# EAGLE schematic Schematic of PAPR v11 (EAGLE 9.7.0)
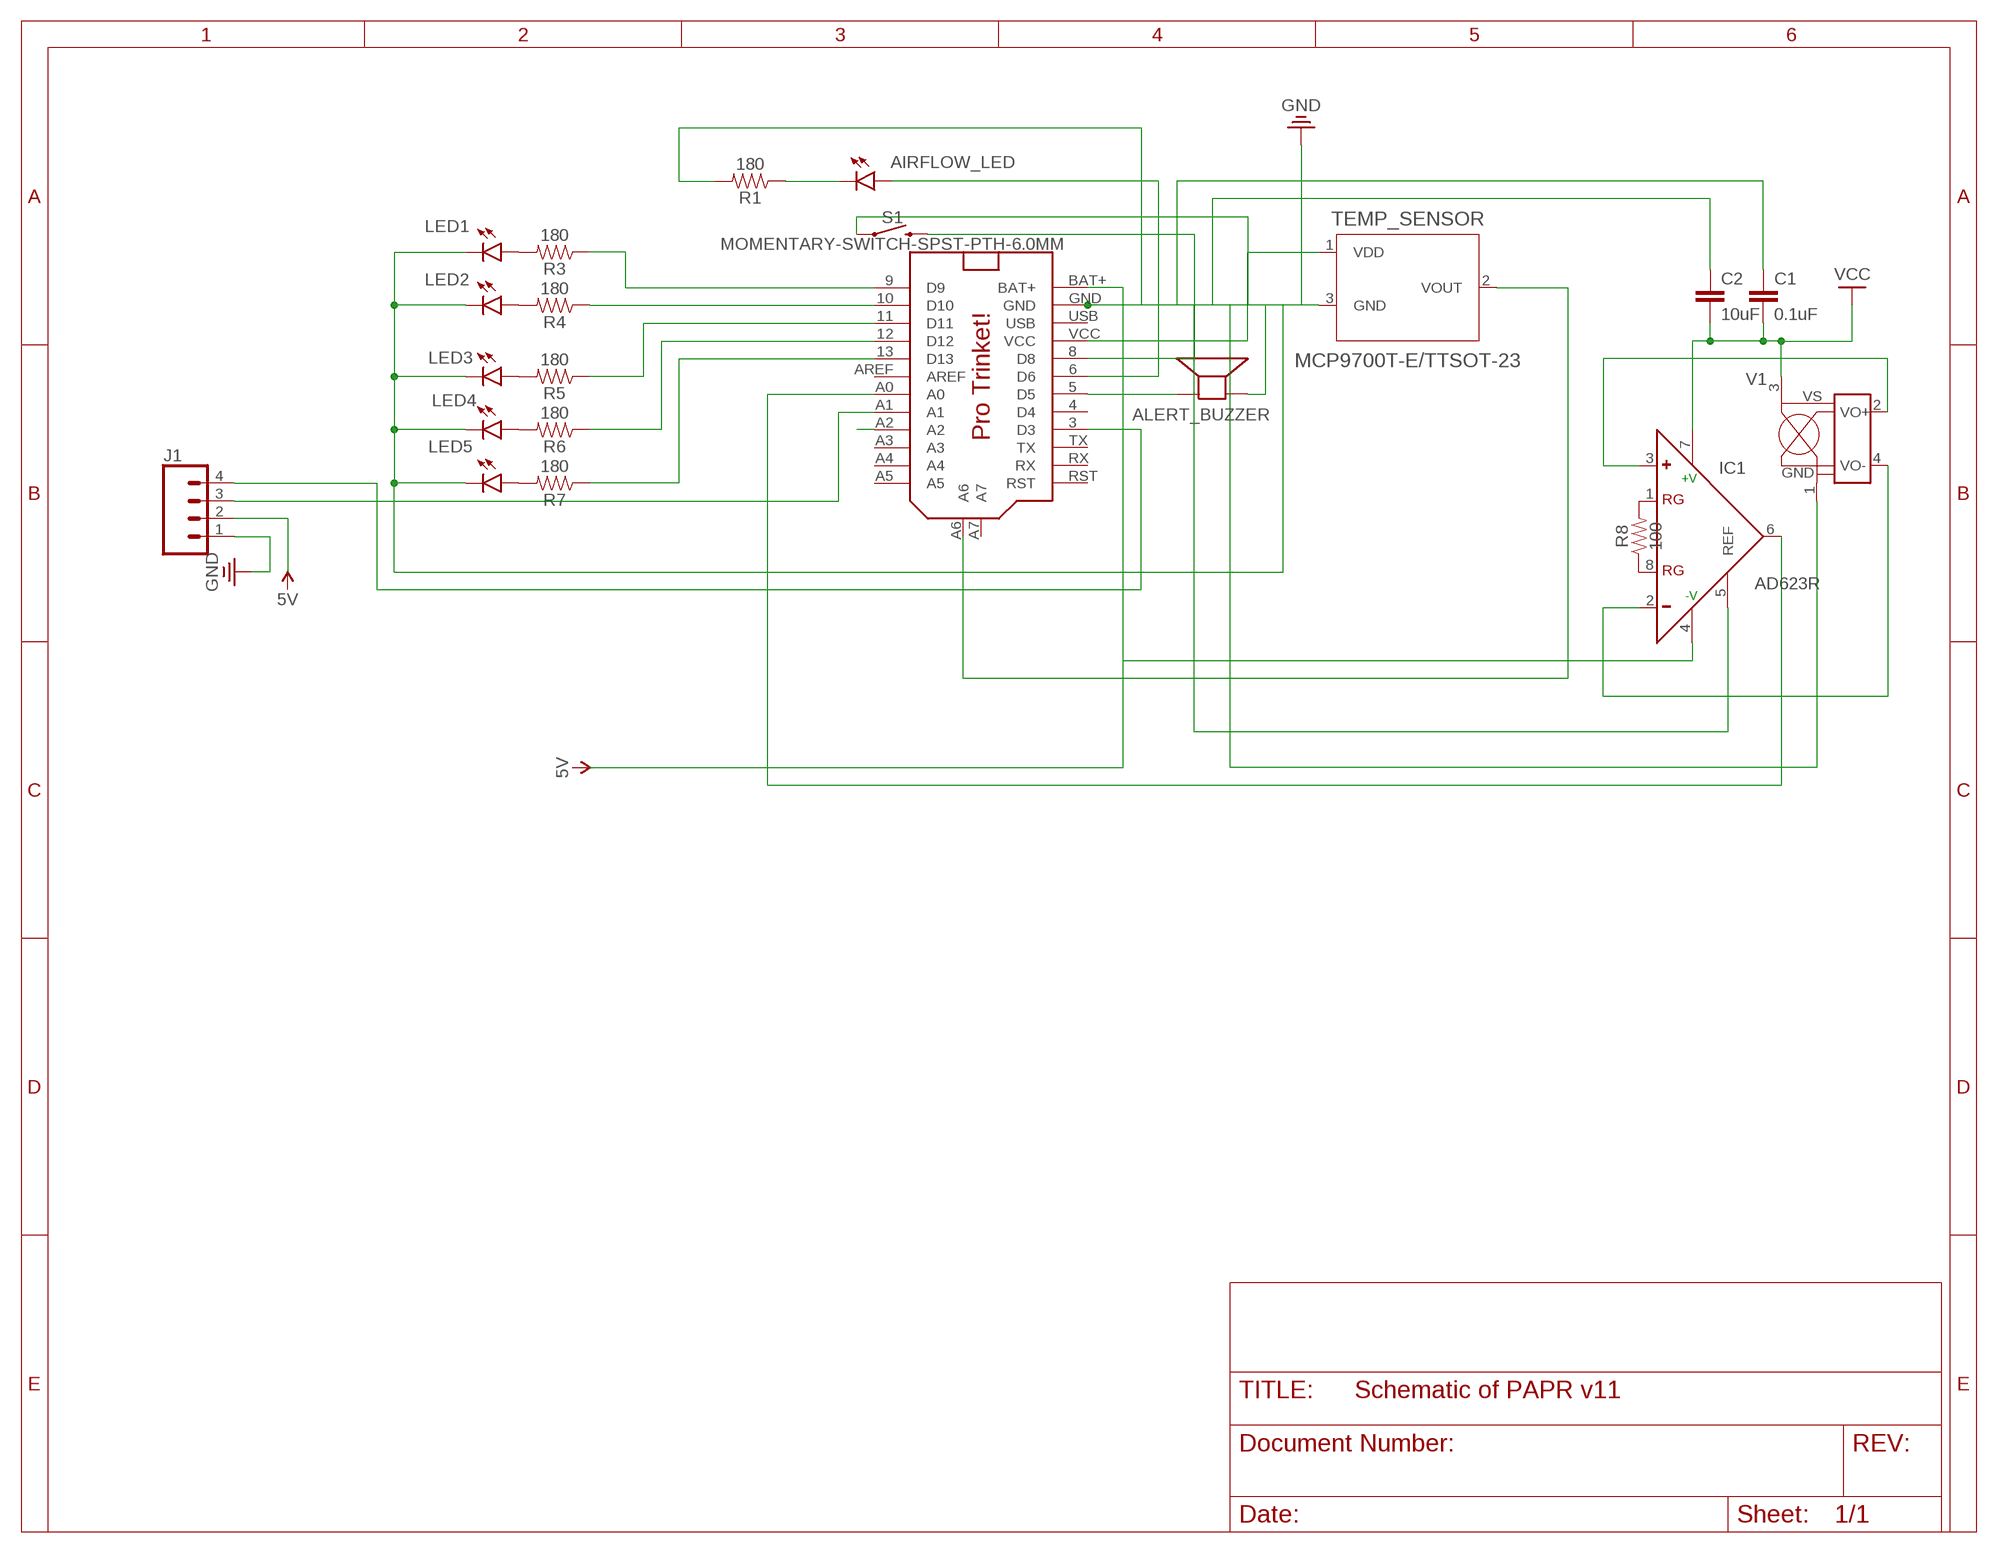
[diagram p0: schematic, sheet 1]

## Parts
AIRFLOW_LED  LED_CHIP_RED-1608  [LEDC1608X39N_R]
ALERT_BUZZER  SMT-0540-S-R  [SMT-0540-S-R]
C1  0.1uF  0.1UF-0402-16V-10%  [0402]
C2  10uF  10UF-0603-6.3V-20%  [0603]
IC1  AD623R  [SO8]
J1  CONN_04JST-PTH-VERT  [JST-4-PTH-VERT]
LED1  LED_CHIP_RED-1608  [LEDC1608X39N_R]
LED2  LED_CHIP_RED-1608  [LEDC1608X39N_R]
LED3  LED_CHIP_GREEN-1608  [LEDC1608X39N_G]
LED4  LED_CHIP_GREEN-1608  [LEDC1608X39N_G]
LED5  LED_CHIP_GREEN-1608  [LEDC1608X39N_G]
R1  180  180OHM-0603-1/10W-1%  [0603]
R3  180  180OHM-0603-1/10W-1%  [0603]
R4  180  180OHM-0603-1/10W-1%  [0603]
R5  180  180OHM-0603-1/10W-1%  [0603]
R6  180  180OHM-0603-1/10W-1%  [0603]
R7  180  180OHM-0603-1/10W-1%  [0603]
R8  100  100OHM-0603-1/4W-5%  [0603]
S1  MOMENTARY-SWITCH-SPST-PTH-6.0MM  [TACTILE_SWITCH_PTH_6.0MM]
TEMP_SENSOR  MCP9700T-E/TTSOT-23  [SOT95P237X112-3N]
U$2  PRO_TRINKET  [PROTRINKET]
V1  MPX2050GPV  [MPX2050GPV]

## Nets
GND: ALERT_BUZZER.+(-) C1.1 C2.1 IC1.4(-V) IC1.5(REF) J1.1 LED1.2(C) LED2.2(C) LED3.2(C) LED4.2(C) LED5.2(C) R1.2 S1.1 TEMP_SENSOR.3(GND) U$2.GND V1.1(GND)
N$1: AIRFLOW_LED.1(A) U$2.6(D6)
N$2: R7.1 U$2.13(D13)
N$3: AIRFLOW_LED.2(C) R1.1
N$4: S1.3 U$2.8(D8)
N$5: ALERT_BUZZER.-(+) U$2.5(D5)
N$6: TEMP_SENSOR.1(VDD) U$2.VCC
N$7: LED1.1(A) R3.2
N$8: LED2.1(A) R4.2
N$9: LED3.1(A) R5.2
N$10: LED4.1(A) R6.2
N$11: LED5.1(A) R7.2
N$12: R3.1 U$2.9(D9)
N$13: R4.1 U$2.10(D10)
N$14: R5.1 U$2.11(D11)
N$15: R6.1 U$2.12(D12)
N$16: IC1.1(RG) R8.2
N$17: IC1.8(RG) R8.1
N$19: IC1.3(+) V1.2(VO+)
N$20: IC1.2(-) V1.4(VO-)
N$21: TEMP_SENSOR.2(VOUT) U$2.A6
N$23: IC1.6(OUT) U$2.A0
N$24: U$2.BAT+
N$25: J1.3 U$2.A1
N$26: J1.4 U$2.3(D3)
N$28: J1.2
N$30: U$2.A2
VCC: C1.2 C2.2 IC1.7(+V) V1.3(VS)
Unconnected: U$2.4(D4) U$2.A3 U$2.A4 U$2.A5 U$2.A7 U$2.AREF U$2.RST U$2.RX U$2.TX

## Power pins joined to a net without a drawn wire
USB: U$2.USB

## Library data of the parts
AIRFLOW_LED LED1 LED2 = Tutorial - Fusion 360:LED_CHIP: LED - Generic; CATEGORY: Opto-Electronic; COLOR: Red; SUB-CATEGORY: LED
ALERT_BUZZER = adafruit:SMT-0540-S-R: SMT-0549-S-R Small surface-mount magnetic buzzer
C1 = SparkFun-Capacitors:0.1UF: 0.1µF ceramic capacitors A capacitor is a passive two-terminal electrical component used to store electrical energy temporarily in an electric field.; PROD_ID: CAP-12416
C2 = SparkFun-Capacitors:10UF: 10.0µF ceramic capacitors A capacitor is a passive two-terminal electrical component used to store electrical energy temporarily in an electric field.; PROD_ID: CAP-11015
IC1 = analog-devices:AD623: Single-Supply, Rail-to-Rail, Low Cost Instrumentation Amplifier Source: http://www.analog.com/static/imported-files/data_sheets/AD623.pdf; MPN: AD623ARZ.; OC_FARNELL: 9426213; OC_NEWARK: 31M4186
J1 = SparkFun-Connectors:CONN_04: Multi connection point. Often used as Generic Header-pin footprint for 0.1 inch spaced/style header connections On any of the 0.1 inch spaced packages, you can populate with these: Break Away Headers - Straight <https://www.sparkfun.com/products/116> (PRT-00116) Break Away Male Headers - Right Angle <https://www.sparkfun.com/products/553> (PRT-00553) Female Headers <https://www.sparkfun.com/products/115> (PRT-00115) Break Away Headers - Machine Pin <https://www.sparkfun.com/products/117> (PRT-00117) Break Away Female Headers - Swiss Machine Pin <https://www.sparkfun.com/products/743> (PRT-00743) For SCREWTERMINALS and SPRING TERMINALS visit here: Screw Terimnals on SparkFun.com <https://www.sparkfun.com/search/results?term=Screw+Terminals> (5mm/3.5mm/2.54mm spacing) This device is also useful as a general connection point to wire up your design to another part of your project. Our various solder wires solder well into these plated through hole pads. Hook-Up Wire - Assortment (Stranded, 22 AWG) <https://www.sparkfun.com/products/11375> (PRT-11375) Hook-Up Wire - Assortment (Solid Core, 22 AWG) <https://www.sparkfun.com/products/11367> (PRT-11367) View the entire wire category on our website here <https://www.sparkfun.com/categories/141> Special notes: Molex polarized connector foot print use with SKU : PRT-08231 with associated crimp pins and housings. 1MM SMD Version SKU: PRT-10208; PROD_ID: CONN-13251
LED3-LED5 = Tutorial - Fusion 360:LED_CHIP: LED - Generic; CATEGORY: Opto-Electronic; COLOR: Green; SUB-CATEGORY: LED
R1 R3-R7 = SparkFun-Resistors:180OHM: 180Ω resistor A resistor is a passive two-terminal electrical component that implements electrical resistance as a circuit element. Resistors act to reduce current flow, and, at the same time, act to lower voltage levels within circuits. - Wikipedia; PROD_ID: RES-08788
R8 = SparkFun-Resistors:100OHM: 100Ω resistor A resistor is a passive two-terminal electrical component that implements electrical resistance as a circuit element. Resistors act to reduce current flow, and, at the same time, act to lower voltage levels within circuits. - Wikipedia; PROD_ID: RES-12438
S1 = SparkFun-Switches:MOMENTARY-SWITCH-SPST: Momentary Switch (Pushbutton) - SPST Normally-open (NO) SPST momentary switches (buttons, pushbuttons). Variants PTH-12MM - 12mm square, through-hole Momentary Pushbutton Switch - 12mm Square <https://www.sparkfun.com/products/9190> (COM-09190) PTH-6.0MM, PTH-6.0MM-KIT - 6.0mm square, through-hole Mini Pushbutton Switch <https://www.sparkfun.com/products/97> (COM-00097) KIT package intended for soldering kit's - only one side of pads' copper is exposed. PTH-RIGHT-ANGLE-KIT - Right-angle, through-hole Right Angle Tactile Button <https://www.sparkfun.com/products/10791> - Used on SparkFun BigTime Watch Kit <https://www.sparkfun.com/products/11734> SMD-12MM - 12mm square, surface-mount Tactile Button - SMD (12mm) <https://www.sparkfun.com/products/12993> (COM-12993) Used on SparkFun PicoBoard <https://www.sparkfun.com/products/11888> SMD-4.5MM - 4.5mm Square Trackball Switch Used on SparkFun Blackberry Trackballer Breakout <https://www.sparkfun.com/products/13169> SMD-4.6MMX2.8MM - 4.60mm x 2.80mm, surface mount Used on SparkFun SAMD21 Mini Breakout <https://www.sparkfun.com/products/13664> SMD-5.2MM, SMD-5.2-REDUNDANT - 5.2mm square, surface-mount Mini Pushbutton Switch - SMD <https://www.sparkfun.com/products/8720> (COM-08720) Used on Arduino Pro Mini <https://www.sparkfun.com/products/11114> REDUNDANT package connects both switch circuits together SMD-6.0X3.5MM - 6.0 x 3.5mm, surface mount Momentary Reset Switch SMD <https://www.sparkfun.com/products/8229> (COM-08229) SMD-6.2MM-TALL - 6.2mm square, surface mount Tactile Button - SMD (6mm) <https://www.sparkfun.com/products/12992> Used on SparkFun Digital Sandbox <https://www.sparkfun.com/products/12651> SMD-RIGHT-ANGLE - Right-angle, surface mount Used on SparkFun Block for Intel® Edison - Arduino <https://www.sparkfun.com/products/13036>; PROD_ID: SWCH-08441; SF_SKU: COM-00097
TEMP_SENSOR = Sensor:MCP9700T-E/TT: SENSOR ANALOG -40C-125C SOT23-3; CATEGORY: Sensor; SUB-CATEGORY: Temperature
U$2 = adafruit:PRO_TRINKET
V1 = motorola-sensor-driver:MPX2050*: 50 kPa Pressure Sensor On-Chip Temparetur Compensated & Calibrated Silicon Pressure Sensor; MF: MOTOROLA; MPN: MPX2050GP; OC_FARNELL: 8814910; OC_NEWARK: 48F6767